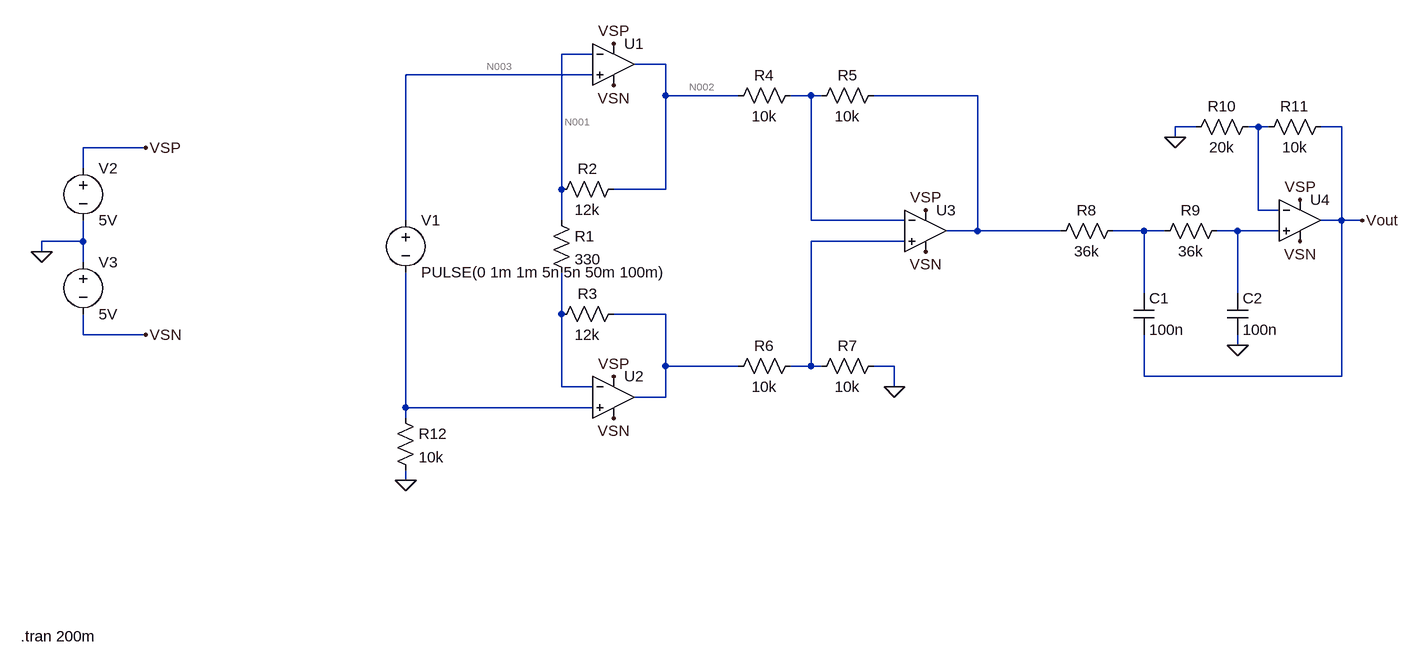
[diagram p0: schematic analiza_ex4.asc]
analiza_ex4.asc, the LTspice schematic file:
Version 4
SHEET 1 1272 680
WIRE 16 -688 -32 -688
WIRE 128 -672 80 -672
WIRE 16 -656 -272 -656
WIRE 128 -624 128 -672
WIRE 240 -624 128 -624
WIRE 352 -624 320 -624
WIRE 368 -624 352 -624
WIRE 608 -624 448 -624
WIRE 944 -576 912 -576
WIRE 1040 -576 1024 -576
WIRE 1056 -576 1040 -576
WIRE 1168 -576 1136 -576
WIRE 912 -560 912 -576
WIRE -672 -544 -768 -544
WIRE -768 -512 -768 -544
WIRE -32 -480 -32 -688
WIRE 128 -480 128 -624
WIRE 128 -480 48 -480
WIRE 1040 -448 1040 -576
WIRE 1072 -448 1040 -448
WIRE -272 -432 -272 -656
WIRE -32 -432 -32 -480
WIRE 352 -432 352 -624
WIRE 496 -432 352 -432
WIRE 1168 -432 1168 -576
WIRE 1168 -432 1136 -432
WIRE 1200 -432 1168 -432
WIRE 608 -416 608 -624
WIRE 608 -416 560 -416
WIRE 736 -416 608 -416
WIRE 864 -416 816 -416
WIRE 896 -416 864 -416
WIRE 1008 -416 976 -416
WIRE 1072 -416 1008 -416
WIRE -768 -400 -768 -432
WIRE -768 -400 -832 -400
WIRE 496 -400 352 -400
WIRE -832 -384 -832 -400
WIRE -768 -368 -768 -400
WIRE 864 -320 864 -416
WIRE 1008 -320 1008 -416
WIRE -32 -288 -32 -352
WIRE 128 -288 48 -288
WIRE -768 -256 -768 -288
WIRE -672 -256 -768 -256
WIRE 1008 -240 1008 -256
WIRE 128 -208 128 -288
WIRE 240 -208 128 -208
WIRE 352 -208 352 -400
WIRE 352 -208 320 -208
WIRE 368 -208 352 -208
WIRE 480 -208 448 -208
WIRE 864 -192 864 -256
WIRE 1168 -192 1168 -432
WIRE 1168 -192 864 -192
WIRE -32 -176 -32 -288
WIRE 16 -176 -32 -176
WIRE 480 -176 480 -208
WIRE 128 -160 128 -208
WIRE 128 -160 80 -160
WIRE -272 -144 -272 -352
WIRE 16 -144 -272 -144
WIRE -272 -128 -272 -144
WIRE -272 -32 -272 -48
FLAG -832 -384 0
FLAG -672 -544 VSP
FLAG -672 -256 VSN
FLAG -272 -32 0
FLAG 48 -704 VSP
FLAG 48 -192 VSP
FLAG 48 -640 VSN
FLAG 48 -128 VSN
FLAG 480 -176 0
FLAG 528 -448 VSP
FLAG 528 -384 VSN
FLAG 1008 -240 0
FLAG 912 -560 0
FLAG 1104 -464 VSP
FLAG 1104 -400 VSN
FLAG 1200 -432 Vout
SYMBOL voltage -768 -528 R0
SYMATTR InstName V2
SYMATTR Value 5V
SYMBOL voltage -768 -384 R0
SYMATTR InstName V3
SYMATTR Value 5V
SYMBOL voltage -272 -448 R0
WINDOW 123 24 44 Left 2
WINDOW 39 0 0 Left 0
SYMATTR InstName V1
SYMATTR Value PULSE(0 1m 1m 5n 5n 50m 100m)
SYMBOL res -288 -144 R0
SYMATTR InstName R12
SYMATTR Value 10k
SYMBOL OpAmps\\UniversalOpAmp2 48 -672 R0
SYMATTR InstName U1
SYMBOL OpAmps\\UniversalOpAmp2 48 -160 R0
SYMATTR InstName U2
SYMBOL res -48 -448 R0
SYMATTR InstName R1
SYMATTR Value 330
SYMBOL res 64 -496 R90
WINDOW 0 0 56 VBottom 2
WINDOW 3 32 56 VTop 2
SYMATTR InstName R2
SYMATTR Value 12k
SYMBOL res 64 -304 R90
WINDOW 0 0 56 VBottom 2
WINDOW 3 32 56 VTop 2
SYMATTR InstName R3
SYMATTR Value 12k
SYMBOL res 336 -640 R90
WINDOW 0 0 56 VBottom 2
WINDOW 3 32 56 VTop 2
SYMATTR InstName R4
SYMATTR Value 10k
SYMBOL res 464 -640 R90
WINDOW 0 0 56 VBottom 2
WINDOW 3 32 56 VTop 2
SYMATTR InstName R5
SYMATTR Value 10k
SYMBOL res 336 -224 R90
WINDOW 0 0 56 VBottom 2
WINDOW 3 32 56 VTop 2
SYMATTR InstName R6
SYMATTR Value 10k
SYMBOL res 464 -224 R90
WINDOW 0 0 56 VBottom 2
WINDOW 3 32 56 VTop 2
SYMATTR InstName R7
SYMATTR Value 10k
SYMBOL res 832 -432 R90
WINDOW 0 0 56 VBottom 2
WINDOW 3 32 56 VTop 2
SYMATTR InstName R8
SYMATTR Value 36k
SYMBOL OpAmps\\UniversalOpAmp2 528 -416 R0
SYMATTR InstName U3
SYMBOL res 992 -432 R90
WINDOW 0 0 56 VBottom 2
WINDOW 3 32 56 VTop 2
SYMATTR InstName R9
SYMATTR Value 36k
SYMBOL cap 848 -320 R0
SYMATTR InstName C1
SYMATTR Value 100n
SYMBOL cap 992 -320 R0
SYMATTR InstName C2
SYMATTR Value 100n
SYMBOL OpAmps\\UniversalOpAmp2 1104 -432 R0
SYMATTR InstName U4
SYMBOL res 1152 -592 R90
WINDOW 0 0 56 VBottom 2
WINDOW 3 32 56 VTop 2
SYMATTR InstName R11
SYMATTR Value 10k
SYMBOL res 1040 -592 R90
WINDOW 0 0 56 VBottom 2
WINDOW 3 32 56 VTop 2
SYMATTR InstName R10
SYMATTR Value 20k
TEXT -864 208 Left 2 !.tran 200m

The netlist it stands for:
* analiza_ex4.asc
V2 VSP 0 5V
V3 0 VSN 5V
V1 N003 N012 PULSE(0 1m 1m 5n 5n 50m 100m)
R12 N012 0 10k
XU1 N003 N001 VSP VSN N002 level2 Avol=1Meg GBW=10Meg Slew=10Meg Ilimit=25m Rail=0 Vos=0 En=0 Enk=0 In=0 Ink=0 Rin=500Meg  ; pins In+ In- V+ V- OUT
XU2 N012 N010 VSP VSN N011 level2 Avol=1Meg GBW=10Meg Slew=10Meg Ilimit=25m Rail=0 Vos=0 En=0 Enk=0 In=0 Ink=0 Rin=500Meg  ; pins In+ In- V+ V- OUT
R1 N001 N010 330
R2 N002 N001 12k
R3 N011 N010 12k
R4 N004 N002 10k
R5 N005 N004 10k
R6 N009 N011 10k
R7 0 N009 10k
R8 N007 N005 36k
XU3 N009 N004 VSP VSN N005 level2 Avol=1Meg GBW=10Meg Slew=10Meg Ilimit=25m Rail=0 Vos=0 En=0 Enk=0 In=0 Ink=0 Rin=500Meg  ; pins In+ In- V+ V- OUT
R9 N008 N007 36k
C1 N007 Vout 100n
C2 N008 0 100n
XU4 N008 N006 VSP VSN Vout level2 Avol=1Meg GBW=10Meg Slew=10Meg Ilimit=25m Rail=0 Vos=0 En=0 Enk=0 In=0 Ink=0 Rin=500Meg  ; pins In+ In- V+ V- OUT
R11 Vout N006 10k
R10 N006 0 20k
.tran 200m
.lib UniversalOpAmp2.lib
.backanno
.end

* Results of the author's LTspice run, read from the files saved beside the schematic
* Operating Point, zero values left out:
*   V(vsp) = 5 V
*   V(vsn) = -5 V
*   I(V3) = -2 mA
*   I(V2) = -2 mA
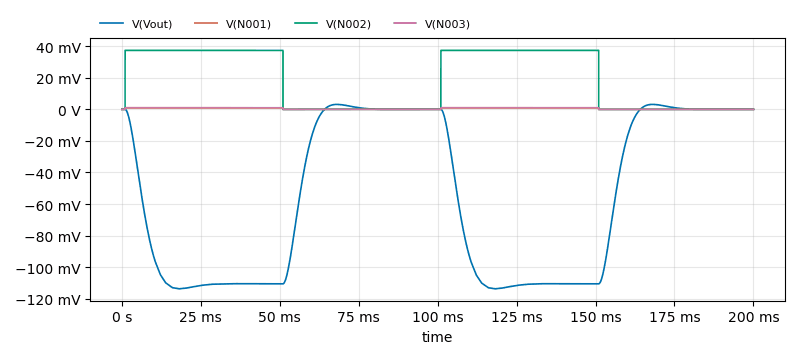
[diagram p1: Transient Analysis of analiza_ex4.asc, plotted from the saved traces]
* Transient Analysis, 1 run:
*   V(Vout): min -113.7 mV, max 3.142 mV, average -55.27 mV, rms 75.78 mV, last 1.846 µV
*   V(N001): min -653.1 nV, max 1 mV, average 500 µV, rms 707.1 µV, last 265.9 pV
*   V(N002): min -47.96 µV, max 37.37 mV, average 18.68 mV, rms 26.42 mV, last 0 V
*   V(N003): min 0 V, max 1 mV, average 500 µV, rms 707.1 µV, last 0 V